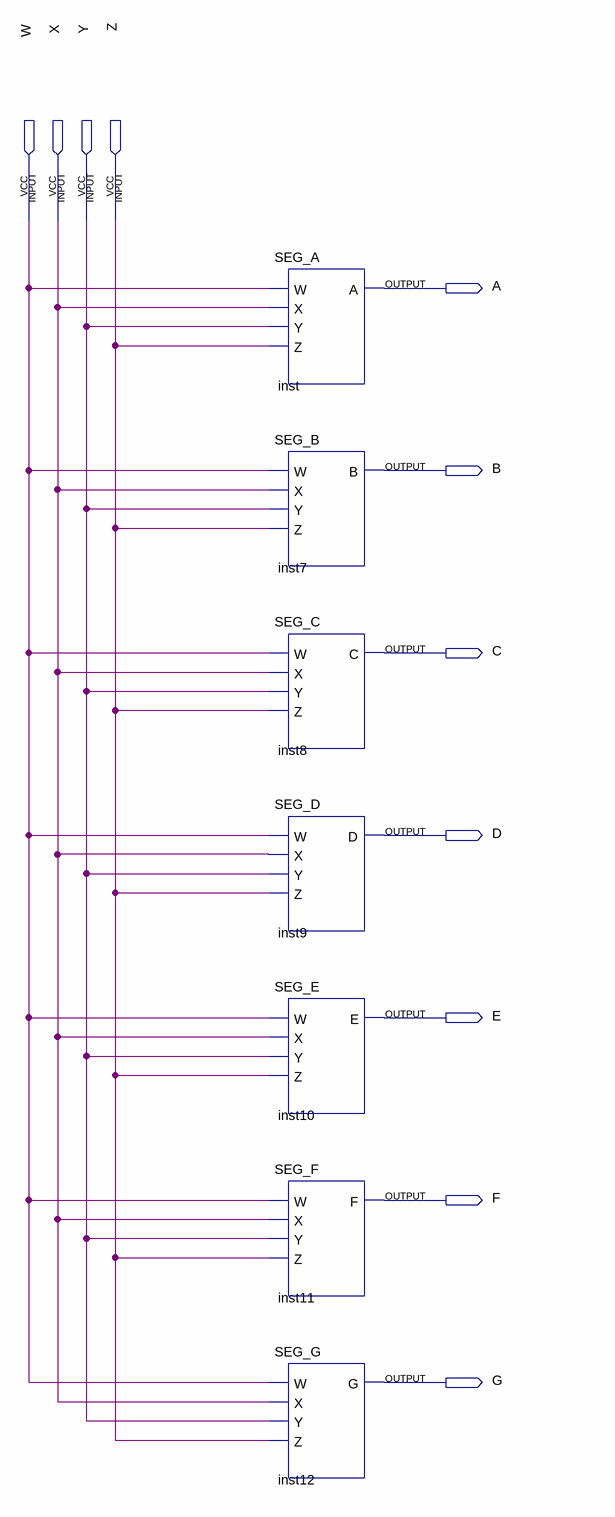
[diagram p0: schematic sheet]
// Quartus schematic HEX2SSD.bdf as structural Verilog: 7 symbols, 11 pins
module HEX2SSD (
  input  W,
  input  X,
  input  Y,
  input  Z,
  output A,
  output B,
  output C,
  output D,
  output E,
  output F,
  output G
);

  SEG_A inst (.W(W), .X(X), .Y(Y), .Z(Z), .A(A));
  SEG_B inst7 (.W(W), .X(X), .Y(Y), .Z(Z), .B(B));
  SEG_C inst8 (.W(W), .X(X), .Y(Y), .Z(Z), .C(C));
  SEG_D inst9 (.W(W), .X(X), .Y(Y), .Z(Z), .D(D));
  SEG_E inst10 (.W(W), .X(X), .Y(Y), .Z(Z), .E(E));
  SEG_F inst11 (.W(W), .X(X), .Y(Y), .Z(Z), .F(F));
  SEG_G inst12 (.W(W), .X(X), .Y(Y), .Z(Z), .G(G));
endmodule
